# Altium schematic sheet Sheet1.SchDoc
size A; SheetNumber: 1; SheetTotal: 1
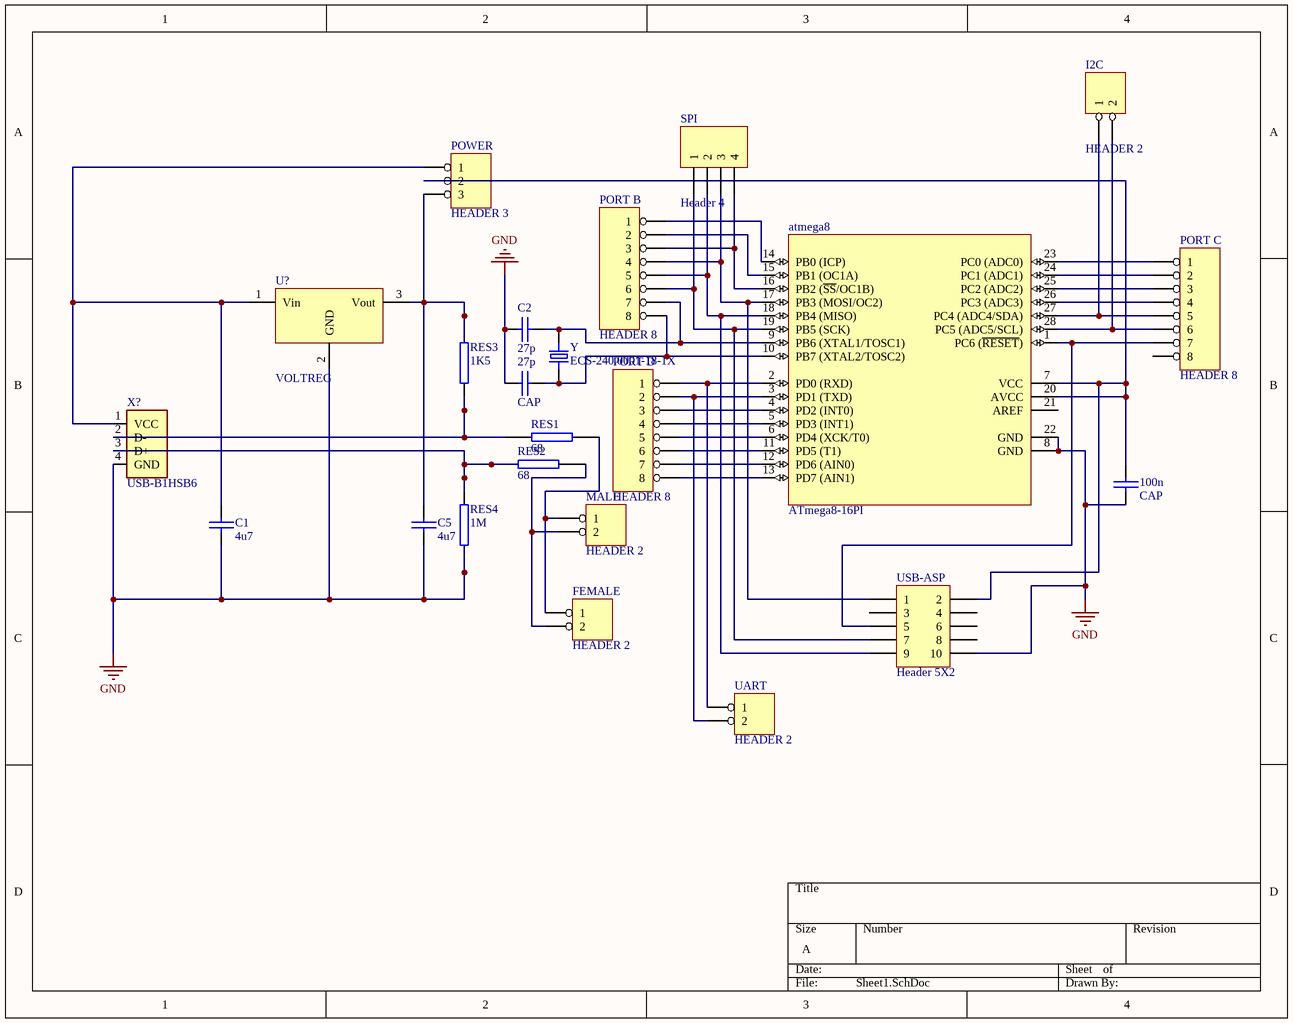
[diagram p0: Sheet1.SchDoc]

## Parts
27p  CAP  [RAD0.1]
100n  CAP  [RAD0.1]
atmega8  ATmega8-16PI  [PDIP28]
C1  4u7  [RAD0.1]
C2  27p  [RAD0.1]
C5  4u7  [RAD0.1]
FEMALE  HEADER 2  [RAD0.2]
I2C  HEADER 2  [RAD0.2]
MALE  HEADER 2  [RAD0.2]
PORT_B  HEADER 8  [SIP8]
PORT_C  HEADER 8  [SIP8]
PORT_D  HEADER 8  [SIP8]
POWER  HEADER 3  [SIP3]
RES1  68  [AXIAL0.3]
RES2  68  [AXIAL0.3]
RES3  1K5  [AXIAL0.3]
RES4  1M  [AXIAL0.3]
SPI  Header 4  [HDR1X4]
U?  VOLTREG  [TO-220]
UART  HEADER 2  [RAD0.2]
USB-ASP  Header 5X2  [HDR2X5]
X?  USB-B1HSB6  [OST_USB-B1HSB6]
Y  ECS-240.0001-18-1X  [XTAL_ECS-200-20-1X]

## Nets
GND: 27p.1 100n.2 atmega8.8(GND) atmega8.22(GND) C1.1 C2.1 C5.2 RES4.1 U?.2(GND) USB-ASP.10 X?.4(GND)
Net27p_2: 27p.2 atmega8.10(PB7_(XTAL2/TOSC2)) PORT_B.8 Y.1
Net100n_1: 100n.1 atmega8.7(VCC) atmega8.20(AVCC) POWER.2 USB-ASP.2
Netatmega8_1: atmega8.1(PC6_(~{RESET})) PORT_C.7 USB-ASP.5
Netatmega8_2: atmega8.2(PD0_(RXD)) PORT_D.1 UART.1
Netatmega8_3: atmega8.3(PD1_(TXD)) PORT_D.2 UART.2
Netatmega8_4: atmega8.4(PD2_(INT0)) PORT_D.3
Netatmega8_5: atmega8.5(PD3_(INT1)) PORT_D.4
Netatmega8_6: atmega8.6(PD4_(XCK/T0)) PORT_D.5
Netatmega8_9: atmega8.9(PB6_(XTAL1/TOSC1)) C2.2 PORT_B.7 Y.2
Netatmega8_11: atmega8.11(PD5_(T1)) PORT_D.6
Netatmega8_12: atmega8.12(PD6_(AIN0)) PORT_D.7
Netatmega8_13: atmega8.13(PD7_(AIN1)) PORT_D.8
Netatmega8_14: atmega8.14(PB0_(ICP)) PORT_B.1
Netatmega8_15: atmega8.15(PB1_(OC1A)) PORT_B.2
Netatmega8_16: atmega8.16(PB2_(~{SS}/OC1B)) PORT_B.3 SPI.4
Netatmega8_17: atmega8.17(PB3_(MOSI/OC2)) PORT_B.4 SPI.3 USB-ASP.1
Netatmega8_18: atmega8.18(PB4_(MISO)) PORT_B.5 SPI.2 USB-ASP.9
Netatmega8_19: atmega8.19(PB5_(SCK)) PORT_B.6 SPI.1 USB-ASP.7
Netatmega8_23: atmega8.23(PC0_(ADC0)) PORT_C.1
Netatmega8_24: atmega8.24(PC1_(ADC1)) PORT_C.2
Netatmega8_25: atmega8.25(PC2_(ADC2)) PORT_C.3
Netatmega8_26: atmega8.26(PC3_(ADC3)) PORT_C.4
Netatmega8_27: atmega8.27(PC4_(ADC4/SDA)) I2C.1 PORT_C.5
Netatmega8_28: atmega8.28(PC5_(ADC5/SCL)) I2C.2 PORT_C.6
NetC1_2: C1.2 POWER.1 U?.1(Vin) X?.1(VCC)
NetC5_1: C5.1 POWER.3 RES3.2 U?.3(Vout)
NetFEMALE_1: FEMALE.1 MALE.1 RES1.2
NetFEMALE_2: FEMALE.2 MALE.2 RES2.2
NetRES1_1: RES1.1 RES3.1 X?.2(D-)
NetRES2_1: RES2.1 RES4.2 X?.3(D+)

Not connected (* = marked no-connect by the designer): atmega8 21(AREF); PORT_C 8; USB-ASP 3 4 6 8

## Library data of the parts
27p 100n C1 C2 C5 = CAP: Capacitor
atmega8 = ATmega8-16PI: AVR 8K Bytes of In-System Programmable Flash Memory; Published: 17-Sep-2003; LatestRevisionDate: 04-Mar-2005; LatestRevisionNote: Stylized 3D Model Added.; DatasheetVersion: 2486H-AVR-09/02; PackageVersion: revB, Sep-2001; PackageReference: 28P3; Publisher: Altium Limited; PackageDescription: DIP; 28 Leads; Row Spacing 7.62 mm; Pitch 2.54 mm; ComponentLink1Description: Manufacturer Link; ComponentLink1URL: http://www.atmel.com; ComponentLink2Description: Datasheet; ComponentLink2URL: http://www.atmel.com/dyn/resources/prod_documents/doc2486.pdf
PORT_B PORT_C PORT_D = HEADER 8: 8 Pin Header
RES1-RES4 = RES2
SPI = Header 4: Header, 4-Pin; LatestRevisionDate: 17-Jul-2002; LatestRevisionNote: Re-released for DXP Platform.; Publisher: Altium Limited
USB-ASP = Header 5X2: Header, 5-Pin, Dual row; LatestRevisionDate: 17-Jul-2002; LatestRevisionNote: Re-released for DXP Platform.; Publisher: Altium Limited
X? = USB-B1HSB6: USB-B (USB TYPE-B) - Receptacle Connector 4 Position Through Hole, Right Angle; MF: On Shore; Check_prices: https://www.snapeda.com/parts/USB-B1HSB6/On+Shore+Technology+Inc./view-part/?ref=eda; Value: *; Purchase-URL: https://pricing.snapeda.com/search/part/USB-B1HSB6/?ref=eda; Price: None; MP: USB-B1HSB6; SnapEDA_Link: https://www.snapeda.com/parts/USB-B1HSB6/On+Shore+Technology+Inc./view-part/?ref=snap; Availability: In Stock; Package: None
Y = ECS-240.0001-18-1X: Crystals / Oscillators / Resonators 24.00014MHz 18pF; MF: ECS International; Package: HC49/U ECS International; Availability: Unavailable; Value: *; MP: ECS-240.0001-18-1X; Price: None; SnapEDA_Link: https://www.snapeda.com/parts/ECS-240.0001-18-1X/ECS%20International/view-part/259232/?ref=snap